# EAGLE schematic MCU (EAGLE 8.1.1)
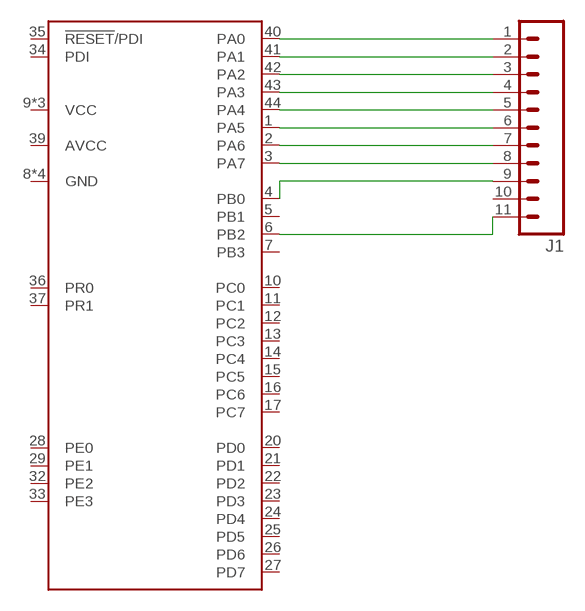
[diagram p0: schematic, sheet 1]

## Parts
J1  M11LONGPADS  [1X11_LONGPADS]
U1  ATXMEGA128A4U-AU  [TQFP-44A-44]

## Nets
N$1: J1.1 U1.40(PA0)
N$2: J1.2 U1.41(PA1)
N$3: J1.3 U1.42(PA2)
N$4: J1.4 U1.43(PA3)
N$5: J1.5 U1.44(PA4)
N$6: J1.6 U1.1(PA5)
N$7: J1.7 U1.2(PA6)
N$8: J1.8 U1.3(PA7)
N$9: J1.9 U1.4(PB0)
N$10: J1.11 U1.6(PB2)
Unconnected: J1.10 U1.5(PB1) U1.7(PB3) U1.10(PC0) U1.11(PC1) U1.12(PC2) U1.13(PC3) U1.14(PC4) U1.15(PC5) U1.16(PC6) U1.17(PC7) U1.20(PD0) U1.21(PD1) U1.22(PD2) U1.23(PD3) U1.24(PD4) U1.25(PD5) U1.26(PD6) U1.27(PD7) U1.28(PE0) U1.29(PE1) U1.32(PE2) U1.33(PE3) U1.34(PDI) U1.35(!RESET!/PDI) U1.36(PR0) U1.37(PR1)

## Power pins joined to a net without a drawn wire
AVCC: U1.39(AVCC)
GND: U1.8(GND) U1.18(GND) U1.30(GND) U1.38(GND)
VCC: U1.9(VCC) U1.19(VCC) U1.31(VCC)

## Library data of the parts
J1 = SparkFun-Connectors:M11: Header 11 Standard 11-pin 0.1" header. Use with straight break away headers (SKU : PRT-00116), right angle break away headers (PRT-00553), swiss pins (PRT-00743), machine pins (PRT-00117), and female headers (PRT-00115).
U1 = atmel-xmega:ATXMEGA128A4U: 8/16-bit XMEGA A4U Microcontroller Features High-performance, low-power Atmel® AVR® XMEGA® 8/16-bit Microcontroller Nonvolatile program and data memories – 16K - 128KBytes of in-system self-programmable flash – 4K - 8KBytes boot section – 1K - 2KBytes EEPROM – 2K - 8KBytes internal SRAM Peripheral Features – Four-channel DMA controller – Eight-channel event system – Five 16-bit timer/counters Three timer/counters with 4 output compare or input capture channels Two timer/counters with 2 output compare or input capture channels High-resolution extensions on all timer/counters Advanced waveform extension (AWeX) on one timer/counter – One USB device interface USB 2.0 full speed (12Mbps) and low speed (1.5Mbps) device compliant 32 Endpoints with full configuration flexibility – Five USARTs with IrDA support for one USART – Two Two-wire interfaces with dual address match (I2C and SMBus compatible) – Two serial peripheral interfaces (SPIs) – AES and DES crypto engine – CRC-16 (CRC-CCITT) and CRC-32 (IEEE® 802.3) generator – 16-bit real time counter (RTC) with separate oscillator – One twelve-channel, 12-bit, 2mspsAnalog to Digital Converter – One two-channel, 12-bit, 1msps Digital to Analog Converter – Two Analog Comparators with window compare function, and current sources – External interrupts on all general purpose I/O pins – Programmable watchdog timer with separate on-chip ultra low power oscillator – QTouch® library support Capacitive touch buttons, sliders and wheels Special microcontroller features – Power-on reset and programmable brown-out detection – Internal and external clock options with PLL and prescaler – Programmable multilevel interrupt controller – Five sleep modes – Programming and debug interfaces PDI (program and debug interface) I/O and packages – 34 Programmable I/O pins – 44 - lead TQFP – 44 - pad VQFN/QFN – 49 - ball VFBGA Operating voltage – 1.6 – 3.6V Operating frequency – 0 – 12MHz from 1.6V – 0 – 32MHz from 2.7V